# Altium schematic sheet ChronomeV3_2.SchDoc: Chronome Button PCB
size D; DrawnBy: Owen Vallis; Revision: 3.2
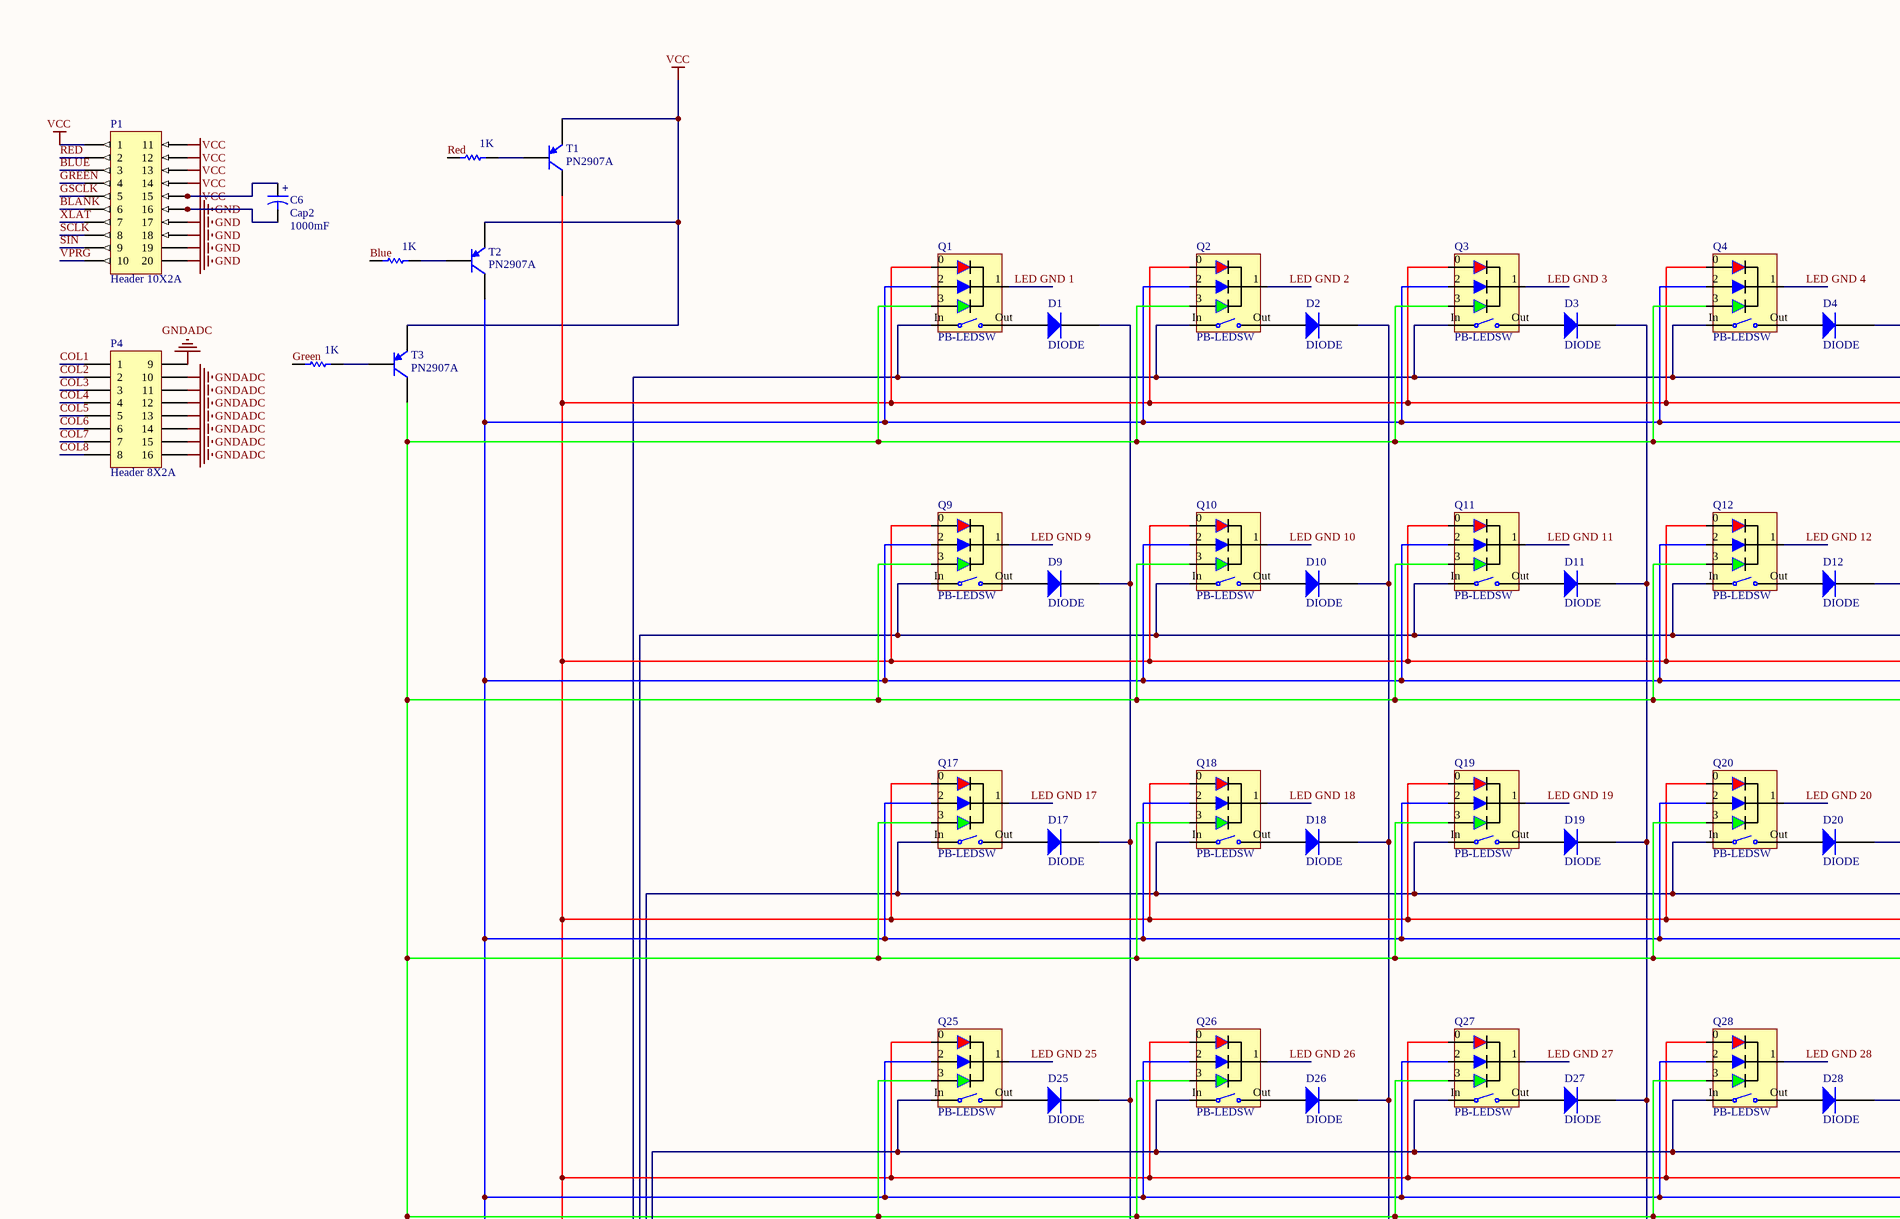
[diagram p0: ChronomeV3_2.SchDoc, top left]
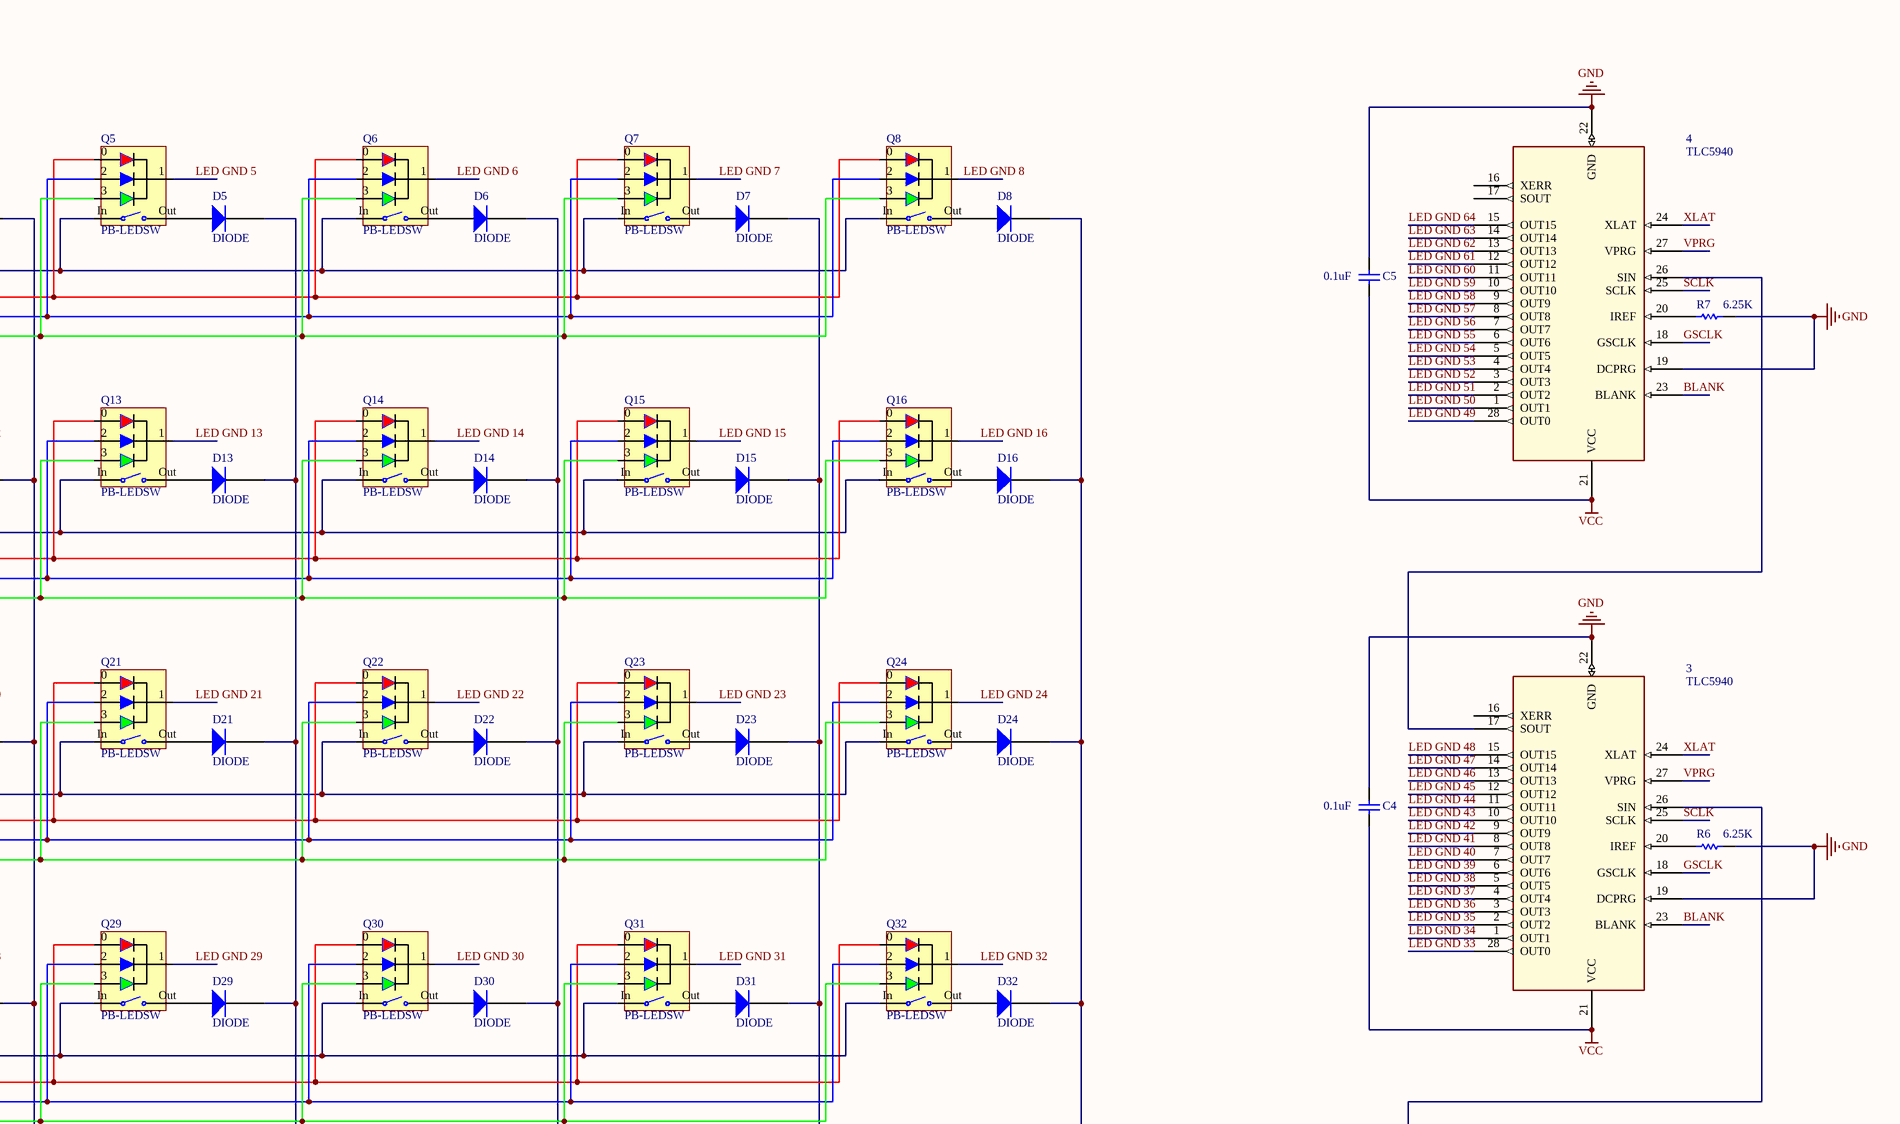
[diagram p1: ChronomeV3_2.SchDoc, top right]
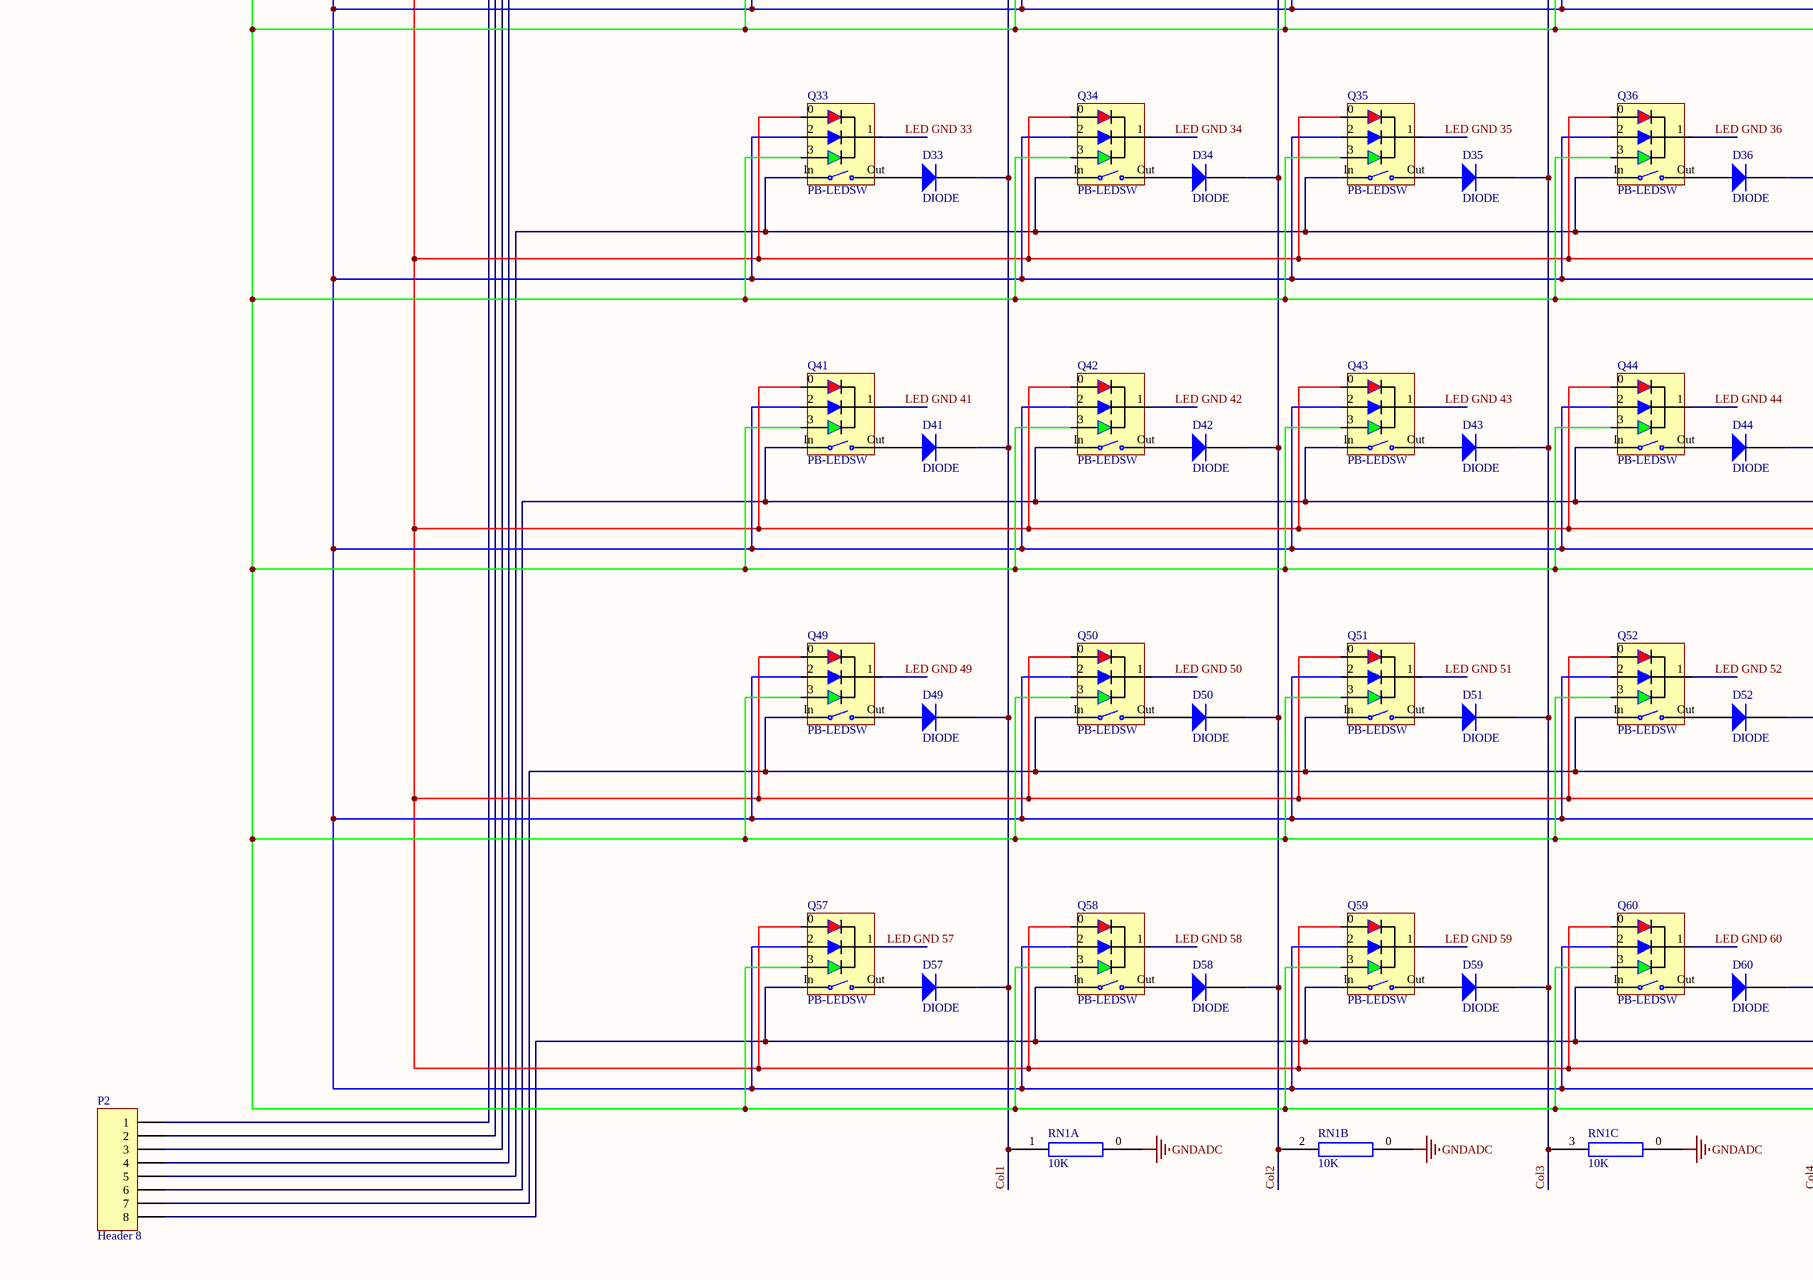
[diagram p2: ChronomeV3_2.SchDoc, bottom left]
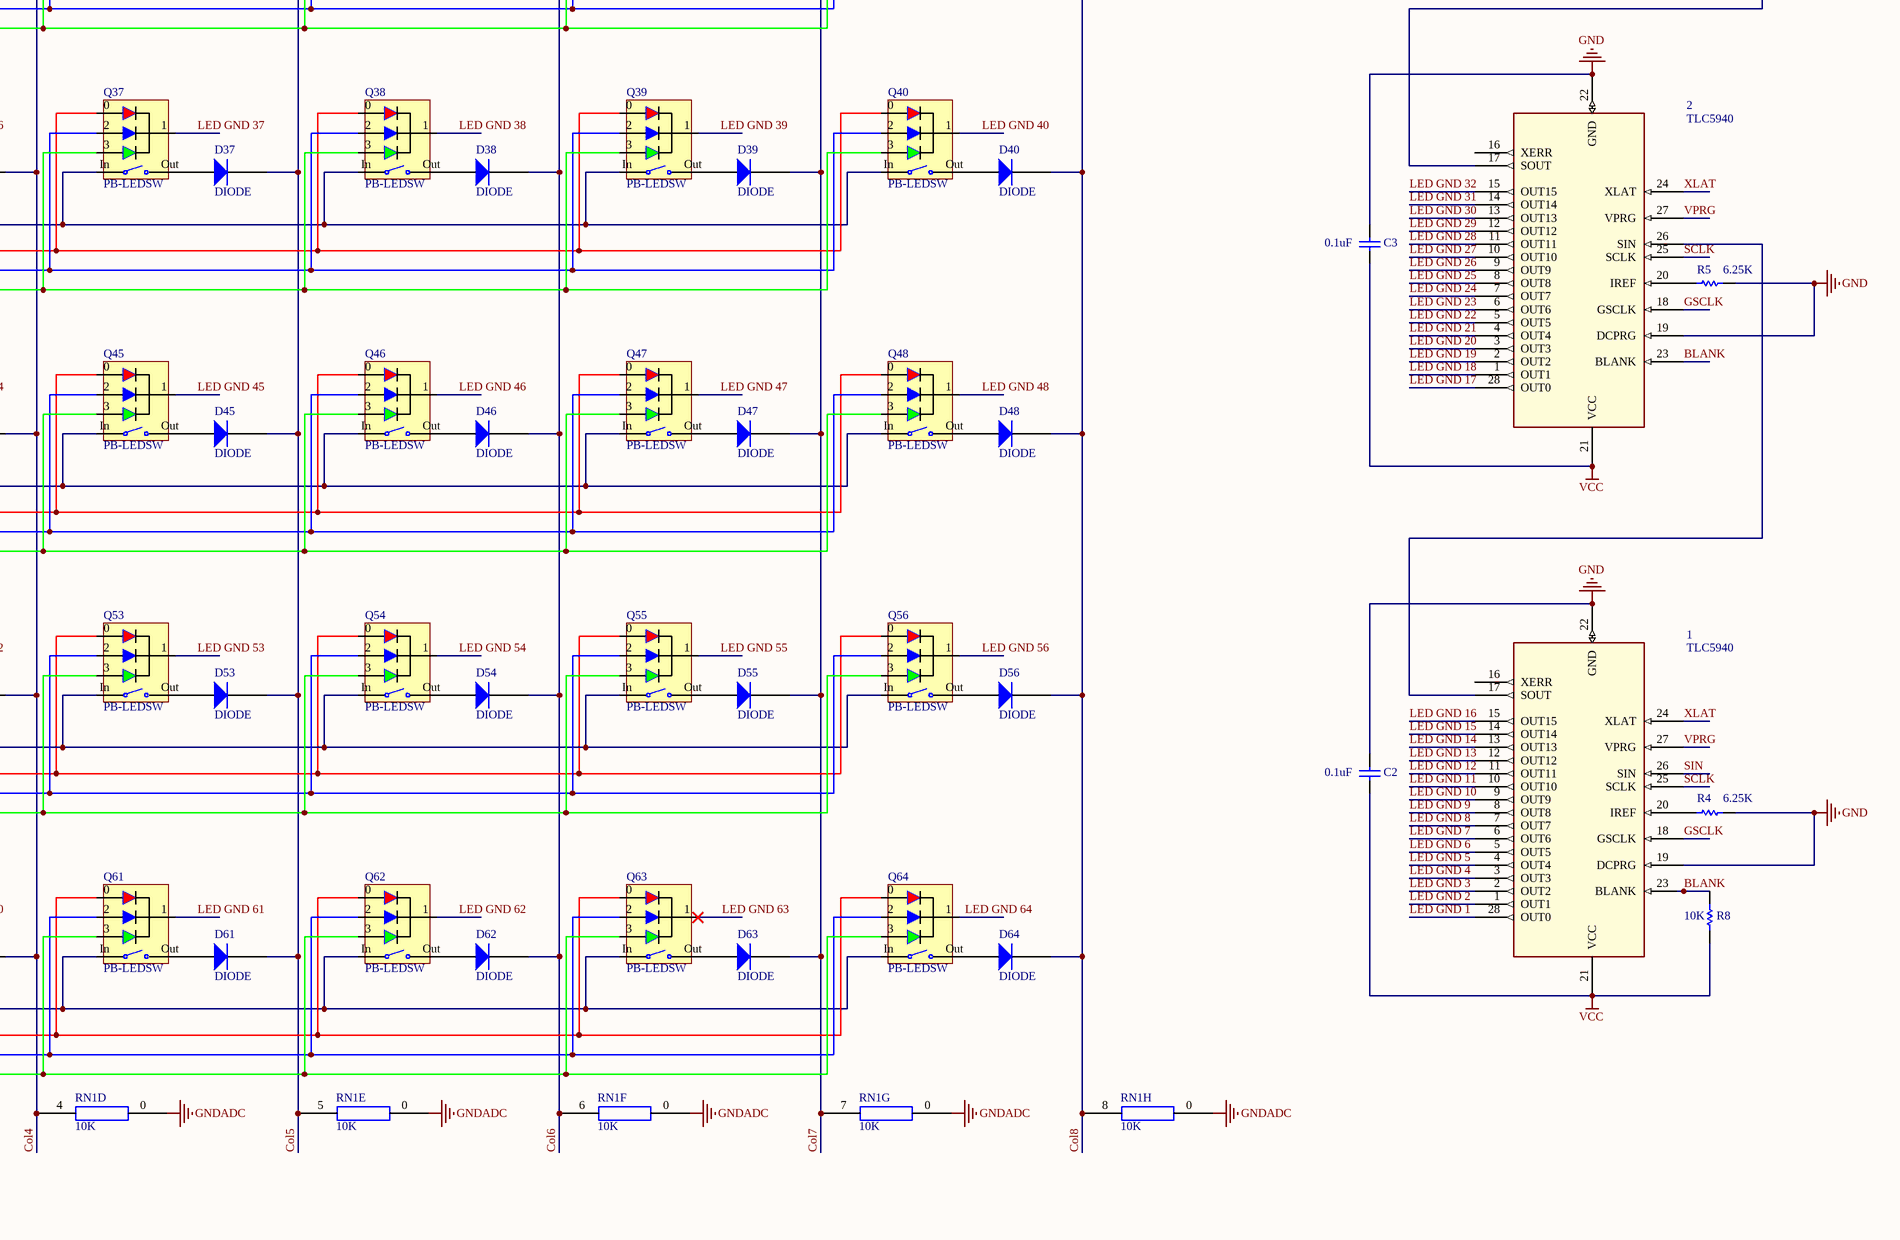
[diagram p3: ChronomeV3_2.SchDoc, bottom right]

## Parts
1  TLC5940  [TLC5940V1]
2  TLC5940  [TLC5940V1]
3  TLC5940  [TLC5940V1]
4  TLC5940  [TLC5940V1]
C2  value 0.1uF  [CAPR2.54-5.1x3.2]  (hidden comment: Cap)
C3  value 0.1uF  [CAPR2.54-5.1x3.2]  (hidden comment: Cap)
C4  value 0.1uF  [CAPR2.54-5.1x3.2]  (hidden comment: Cap)
C5  value 0.1uF  [CAPR2.54-5.1x3.2]  (hidden comment: Cap)
C6  Cap2  value 1000mF  [CAPR5-4X5]
D1  DIODE  [DIODESM]
D2  DIODE  [DIODESM]
D3  DIODE  [DIODESM]
D4  DIODE  [DIODESM]
D5  DIODE  [DIODESM]
D6  DIODE  [DIODESM]
D7  DIODE  [DIODESM]
D8  DIODE  [DIODESM]
D9  DIODE  [DIODESM]
D10  DIODE  [DIODESM]
D11  DIODE  [DIODESM]
D12  DIODE  [DIODESM]
D13  DIODE  [DIODESM]
D14  DIODE  [DIODESM]
D15  DIODE  [DIODESM]
D16  DIODE  [DIODESM]
D17  DIODE  [DIODESM]
D18  DIODE  [DIODESM]
D19  DIODE  [DIODESM]
D20  DIODE  [DIODESM]
D21  DIODE  [DIODESM]
D22  DIODE  [DIODESM]
D23  DIODE  [DIODESM]
D24  DIODE  [DIODESM]
D25  DIODE  [DIODESM]
D26  DIODE  [DIODESM]
D27  DIODE  [DIODESM]
D28  DIODE  [DIODESM]
D29  DIODE  [DIODESM]
D30  DIODE  [DIODESM]
D31  DIODE  [DIODESM]
D32  DIODE  [DIODESM]
D33  DIODE  [DIODESM]
D34  DIODE  [DIODESM]
D35  DIODE  [DIODESM]
D36  DIODE  [DIODESM]
D37  DIODE  [DIODESM]
D38  DIODE  [DIODESM]
D39  DIODE  [DIODESM]
D40  DIODE  [DIODESM]
D41  DIODE  [DIODESM]
D42  DIODE  [DIODESM]
D43  DIODE  [DIODESM]
D44  DIODE  [DIODESM]
D45  DIODE  [DIODESM]
D46  DIODE  [DIODESM]
D47  DIODE  [DIODESM]
D48  DIODE  [DIODESM]
D49  DIODE  [DIODESM]
D50  DIODE  [DIODESM]
D51  DIODE  [DIODESM]
D52  DIODE  [DIODESM]
D53  DIODE  [DIODESM]
D54  DIODE  [DIODESM]
D55  DIODE  [DIODESM]
D56  DIODE  [DIODESM]
D57  DIODE  [DIODESM]
D58  DIODE  [DIODESM]
D59  DIODE  [DIODESM]
D60  DIODE  [DIODESM]
D61  DIODE  [DIODESM]
D62  DIODE  [DIODESM]
D63  DIODE  [DIODESM]
D64  DIODE  [DIODESM]
P1  Header 10X2A  [HDR2X10_CEN]
P2  Header 8  [HDR1X8]
P4  Header 8X2A  [HDR2X8_CEN]
Q1  PB-LEDSW  [RGB_PushButtonV3]
Q2  PB-LEDSW  [RGB_PushButtonV3]
Q3  PB-LEDSW  [RGB_PushButtonV3]
Q4  PB-LEDSW  [RGB_PushButtonV3]
Q5  PB-LEDSW  [RGB_PushButtonV3]
Q6  PB-LEDSW  [RGB_PushButtonV3]
Q7  PB-LEDSW  [RGB_PushButtonV3]
Q8  PB-LEDSW  [RGB_PushButtonV3]
Q9  PB-LEDSW  [RGB_PushButtonV3]
Q10  PB-LEDSW  [RGB_PushButtonV3]
Q11  PB-LEDSW  [RGB_PushButtonV3]
Q12  PB-LEDSW  [RGB_PushButtonV3]
Q13  PB-LEDSW  [RGB_PushButtonV3]
Q14  PB-LEDSW  [RGB_PushButtonV3]
Q15  PB-LEDSW  [RGB_PushButtonV3]
Q16  PB-LEDSW  [RGB_PushButtonV3]
Q17  PB-LEDSW  [RGB_PushButtonV3]
Q18  PB-LEDSW  [RGB_PushButtonV3]
Q19  PB-LEDSW  [RGB_PushButtonV3]
Q20  PB-LEDSW  [RGB_PushButtonV3]
Q21  PB-LEDSW  [RGB_PushButtonV3]
Q22  PB-LEDSW  [RGB_PushButtonV3]
Q23  PB-LEDSW  [RGB_PushButtonV3]
Q24  PB-LEDSW  [RGB_PushButtonV3]
Q25  PB-LEDSW  [RGB_PushButtonV3]
Q26  PB-LEDSW  [RGB_PushButtonV3]
Q27  PB-LEDSW  [RGB_PushButtonV3]
Q28  PB-LEDSW  [RGB_PushButtonV3]
Q29  PB-LEDSW  [RGB_PushButtonV3]
Q30  PB-LEDSW  [RGB_PushButtonV3]
Q31  PB-LEDSW  [RGB_PushButtonV3]
Q32  PB-LEDSW  [RGB_PushButtonV3]
Q33  PB-LEDSW  [RGB_PushButtonV3]
Q34  PB-LEDSW  [RGB_PushButtonV3]
Q35  PB-LEDSW  [RGB_PushButtonV3]
Q36  PB-LEDSW  [RGB_PushButtonV3]
Q37  PB-LEDSW  [RGB_PushButtonV3]
Q38  PB-LEDSW  [RGB_PushButtonV3]
Q39  PB-LEDSW  [RGB_PushButtonV3]
Q40  PB-LEDSW  [RGB_PushButtonV3]
Q41  PB-LEDSW  [RGB_PushButtonV3]
Q42  PB-LEDSW  [RGB_PushButtonV3]
Q43  PB-LEDSW  [RGB_PushButtonV3]
Q44  PB-LEDSW  [RGB_PushButtonV3]
Q45  PB-LEDSW  [RGB_PushButtonV3]
Q46  PB-LEDSW  [RGB_PushButtonV3]
Q47  PB-LEDSW  [RGB_PushButtonV3]
Q48  PB-LEDSW  [RGB_PushButtonV3]
Q49  PB-LEDSW  [RGB_PushButtonV3]
Q50  PB-LEDSW  [RGB_PushButtonV3]
Q51  PB-LEDSW  [RGB_PushButtonV3]
Q52  PB-LEDSW  [RGB_PushButtonV3]
Q53  PB-LEDSW  [RGB_PushButtonV3]
Q54  PB-LEDSW  [RGB_PushButtonV3]
Q55  PB-LEDSW  [RGB_PushButtonV3]
Q56  PB-LEDSW  [RGB_PushButtonV3]
Q57  PB-LEDSW  [RGB_PushButtonV3]
Q58  PB-LEDSW  [RGB_PushButtonV3]
Q59  PB-LEDSW  [RGB_PushButtonV3]
Q60  PB-LEDSW  [RGB_PushButtonV3]
Q61  PB-LEDSW  [RGB_PushButtonV3]
Q62  PB-LEDSW  [RGB_PushButtonV3]
Q63  PB-LEDSW  [RGB_PushButtonV3]
Q64  PB-LEDSW  [RGB_PushButtonV3]
R1  value 1K  [AXIAL-0.3]  (hidden comment: Res1)
R2  value 1K  [AXIAL-0.3]  (hidden comment: Res1)
R3  value 1K  [AXIAL-0.3]  (hidden comment: Res1)
R4  value 6.25K  [AXIAL-0.3]  (hidden comment: Res1)
R5  value 6.25K  [AXIAL-0.3]  (hidden comment: Res1)
R6  value 6.25K  [AXIAL-0.3]  (hidden comment: Res1)
R7  value 6.25K  [AXIAL-0.3]  (hidden comment: Res1)
R8  value 10K  [AXIAL-0.3]  (hidden comment: Res1)
RN1  10K  [9-Pin Resistor Network]  (parts A,B,C,D,E,F,G,H of 8)
T1  PN2907A  [TO-92A]
T2  PN2907A  [TO-92A]
T3  PN2907A  [TO-92A]

## Nets
GND: 1.19(DCPRG) 1.22(GND) 2.19(DCPRG) 2.22(GND) 3.19(DCPRG) 3.22(GND) 4.19(DCPRG) 4.22(GND) C2.2 C3.2 C4.2 C5.2 C6.2 P1.16 P1.17 P1.18 P1.19 P1.20 R4.2 R5.2 R6.2 R7.2
GNDADC: P4.9 P4.10 P4.11 P4.12 P4.13 P4.14 P4.15 P4.16 RN1.0
VCC: 1.21(VCC) 2.21(VCC) 3.21(VCC) 4.21(VCC) C2.1 C3.1 C4.1 C5.1 C6.1 P1.1 P1.11 P1.12 P1.13 P1.14 P1.15 R8.1 T1.1(E) T2.1(E) T3.1(E)
BLANK: 1.23(BLANK) 2.23(BLANK) 3.23(BLANK) 4.23(BLANK) P1.6 R8.2
Blue: P1.3 R2.1
Col1: D1.1 D9.1 D17.1 D25.1 D33.1 D41.1 D49.1 D57.1 P4.1 RN1.1
Col2: D2.1 D10.1 D18.1 D26.1 D34.1 D42.1 D50.1 D58.1 P4.2 RN1.2
Col3: D3.1 D11.1 D19.1 D27.1 D35.1 D43.1 D51.1 D59.1 P4.3 RN1.3
Col4: D4.1 D12.1 D20.1 D28.1 D36.1 D44.1 D52.1 D60.1 P4.4 RN1.4
Col5: D5.1 D13.1 D21.1 D29.1 D37.1 D45.1 D53.1 D61.1 P4.5 RN1.5
Col6: D6.1 D14.1 D22.1 D30.1 D38.1 D46.1 D54.1 D62.1 P4.6 RN1.6
Col7: D7.1 D15.1 D23.1 D31.1 D39.1 D47.1 D55.1 D63.1 P4.7 RN1.7
Col8: D8.1 D16.1 D24.1 D32.1 D40.1 D48.1 D56.1 D64.1 P4.8 RN1.8
Green: P1.4 R3.1
GSCLK: 1.18(GSCLK) 2.18(GSCLK) 3.18(GSCLK) 4.18(GSCLK) P1.5
LED GND 1: 1.28(OUT0) Q1.1(GROUND)
LED GND 2: 1.1(OUT1) Q2.1(GROUND)
LED GND 3: 1.2(OUT2) Q3.1(GROUND)
LED GND 4: 1.3(OUT3) Q4.1(GROUND)
LED GND 5: 1.4(OUT4) Q5.1(GROUND)
LED GND 6: 1.5(OUT5) Q6.1(GROUND)
LED GND 7: 1.6(OUT6) Q7.1(GROUND)
LED GND 8: 1.7(OUT7) Q8.1(GROUND)
LED GND 9: 1.8(OUT8) Q9.1(GROUND)
LED GND 10: 1.9(OUT9) Q10.1(GROUND)
LED GND 11: 1.10(OUT10) Q11.1(GROUND)
LED GND 12: 1.11(OUT11) Q12.1(GROUND)
LED GND 13: 1.12(OUT12) Q13.1(GROUND)
LED GND 14: 1.13(OUT13) Q14.1(GROUND)
LED GND 15: 1.14(OUT14) Q15.1(GROUND)
LED GND 16: 1.15(OUT15) Q16.1(GROUND)
LED GND 17: 2.28(OUT0) Q17.1(GROUND)
LED GND 18: 2.1(OUT1) Q18.1(GROUND)
LED GND 19: 2.2(OUT2) Q19.1(GROUND)
LED GND 20: 2.3(OUT3) Q20.1(GROUND)
LED GND 21: 2.4(OUT4) Q21.1(GROUND)
LED GND 22: 2.5(OUT5) Q22.1(GROUND)
LED GND 23: 2.6(OUT6) Q23.1(GROUND)
LED GND 24: 2.7(OUT7) Q24.1(GROUND)
LED GND 25: 2.8(OUT8) Q25.1(GROUND)
LED GND 26: 2.9(OUT9) Q26.1(GROUND)
LED GND 27: 2.10(OUT10) Q27.1(GROUND)
LED GND 28: 2.11(OUT11) Q28.1(GROUND)
LED GND 29: 2.12(OUT12) Q29.1(GROUND)
LED GND 30: 2.13(OUT13) Q30.1(GROUND)
LED GND 31: 2.14(OUT14) Q31.1(GROUND)
LED GND 32: 2.15(OUT15) Q32.1(GROUND)
LED GND 33: 3.28(OUT0) Q33.1(GROUND)
LED GND 34: 3.1(OUT1) Q34.1(GROUND)
LED GND 35: 3.2(OUT2) Q35.1(GROUND)
LED GND 36: 3.3(OUT3) Q36.1(GROUND)
LED GND 37: 3.4(OUT4) Q37.1(GROUND)
LED GND 38: 3.5(OUT5) Q38.1(GROUND)
LED GND 39: 3.6(OUT6) Q39.1(GROUND)
LED GND 40: 3.7(OUT7) Q40.1(GROUND)
LED GND 41: 3.8(OUT8) Q41.1(GROUND)
LED GND 42: 3.9(OUT9) Q42.1(GROUND)
LED GND 43: 3.10(OUT10) Q43.1(GROUND)
LED GND 44: 3.11(OUT11) Q44.1(GROUND)
LED GND 45: 3.12(OUT12) Q45.1(GROUND)
LED GND 46: 3.13(OUT13) Q46.1(GROUND)
LED GND 47: 3.14(OUT14) Q47.1(GROUND)
LED GND 48: 3.15(OUT15) Q48.1(GROUND)
LED GND 49: 4.28(OUT0) Q49.1(GROUND)
LED GND 50: 4.1(OUT1) Q50.1(GROUND)
LED GND 51: 4.2(OUT2) Q51.1(GROUND)
LED GND 52: 4.3(OUT3) Q52.1(GROUND)
LED GND 53: 4.4(OUT4) Q53.1(GROUND)
LED GND 54: 4.5(OUT5) Q54.1(GROUND)
LED GND 55: 4.6(OUT6) Q55.1(GROUND)
LED GND 56: 4.7(OUT7) Q56.1(GROUND)
LED GND 57: 4.8(OUT8) Q57.1(GROUND)
LED GND 58: 4.9(OUT9) Q58.1(GROUND)
LED GND 59: 4.10(OUT10) Q59.1(GROUND)
LED GND 60: 4.11(OUT11) Q60.1(GROUND)
LED GND 61: 4.12(OUT12) Q61.1(GROUND)
LED GND 62: 4.13(OUT13) Q62.1(GROUND)
LED GND 63: 4.14(OUT14) Q63.1(GROUND)
LED GND 64: 4.15(OUT15) Q64.1(GROUND)
Red: P1.2 R1.1
SCLK: 1.25(SCLK) 2.25(SCLK) 3.25(SCLK) 4.25(SCLK) P1.8
SIN: 1.26(SIN) P1.9
VPRG: 1.27(VPRG) 2.27(VPRG) 3.27(VPRG) 4.27(VPRG) P1.10
XLAT: 1.24(XLAT) 2.24(XLAT) 3.24(XLAT) 4.24(XLAT) P1.7
Net1_17: 1.17(SOUT) 2.26(SIN)
Net1_20: 1.20(IREF) R4.1
Net2_17: 2.17(SOUT) 3.26(SIN)
Net2_20: 2.20(IREF) R5.1
Net3_17: 3.17(SOUT) 4.26(SIN)
Net3_20: 3.20(IREF) R6.1
Net4_20: 4.20(IREF) R7.1
NetD1_0: D1.0 Q1.Out(Switch_Output)
NetD2_0: D2.0 Q2.Out(Switch_Output)
NetD3_0: D3.0 Q3.Out(Switch_Output)
NetD4_0: D4.0 Q4.Out(Switch_Output)
NetD5_0: D5.0 Q5.Out(Switch_Output)
NetD6_0: D6.0 Q6.Out(Switch_Output)
NetD7_0: D7.0 Q7.Out(Switch_Output)
NetD8_0: D8.0 Q8.Out(Switch_Output)
NetD9_0: D9.0 Q9.Out(Switch_Output)
NetD10_0: D10.0 Q10.Out(Switch_Output)
NetD11_0: D11.0 Q11.Out(Switch_Output)
NetD12_0: D12.0 Q12.Out(Switch_Output)
NetD13_0: D13.0 Q13.Out(Switch_Output)
NetD14_0: D14.0 Q14.Out(Switch_Output)
NetD15_0: D15.0 Q15.Out(Switch_Output)
NetD16_0: D16.0 Q16.Out(Switch_Output)
NetD17_0: D17.0 Q17.Out(Switch_Output)
NetD18_0: D18.0 Q18.Out(Switch_Output)
NetD19_0: D19.0 Q19.Out(Switch_Output)
NetD20_0: D20.0 Q20.Out(Switch_Output)
NetD21_0: D21.0 Q21.Out(Switch_Output)
NetD22_0: D22.0 Q22.Out(Switch_Output)
NetD23_0: D23.0 Q23.Out(Switch_Output)
NetD24_0: D24.0 Q24.Out(Switch_Output)
NetD25_0: D25.0 Q25.Out(Switch_Output)
NetD26_0: D26.0 Q26.Out(Switch_Output)
NetD27_0: D27.0 Q27.Out(Switch_Output)
NetD28_0: D28.0 Q28.Out(Switch_Output)
NetD29_0: D29.0 Q29.Out(Switch_Output)
NetD30_0: D30.0 Q30.Out(Switch_Output)
NetD31_0: D31.0 Q31.Out(Switch_Output)
NetD32_0: D32.0 Q32.Out(Switch_Output)
NetD33_0: D33.0 Q33.Out(Switch_Output)
NetD34_0: D34.0 Q34.Out(Switch_Output)
NetD35_0: D35.0 Q35.Out(Switch_Output)
NetD36_0: D36.0 Q36.Out(Switch_Output)
NetD37_0: D37.0 Q37.Out(Switch_Output)
NetD38_0: D38.0 Q38.Out(Switch_Output)
NetD39_0: D39.0 Q39.Out(Switch_Output)
NetD40_0: D40.0 Q40.Out(Switch_Output)
NetD41_0: D41.0 Q41.Out(Switch_Output)
NetD42_0: D42.0 Q42.Out(Switch_Output)
NetD43_0: D43.0 Q43.Out(Switch_Output)
NetD44_0: D44.0 Q44.Out(Switch_Output)
NetD45_0: D45.0 Q45.Out(Switch_Output)
NetD46_0: D46.0 Q46.Out(Switch_Output)
NetD47_0: D47.0 Q47.Out(Switch_Output)
NetD48_0: D48.0 Q48.Out(Switch_Output)
NetD49_0: D49.0 Q49.Out(Switch_Output)
NetD50_0: D50.0 Q50.Out(Switch_Output)
NetD51_0: D51.0 Q51.Out(Switch_Output)
NetD52_0: D52.0 Q52.Out(Switch_Output)
NetD53_0: D53.0 Q53.Out(Switch_Output)
NetD54_0: D54.0 Q54.Out(Switch_Output)
NetD55_0: D55.0 Q55.Out(Switch_Output)
NetD56_0: D56.0 Q56.Out(Switch_Output)
NetD57_0: D57.0 Q57.Out(Switch_Output)
NetD58_0: D58.0 Q58.Out(Switch_Output)
NetD59_0: D59.0 Q59.Out(Switch_Output)
NetD60_0: D60.0 Q60.Out(Switch_Output)
NetD61_0: D61.0 Q61.Out(Switch_Output)
NetD62_0: D62.0 Q62.Out(Switch_Output)
NetD63_0: D63.0 Q63.Out(Switch_Output)
NetD64_0: D64.0 Q64.Out(Switch_Output)
NetP2_1: P2.1 Q1.In(Switch_Input) Q2.In(Switch_Input) Q3.In(Switch_Input) Q4.In(Switch_Input) Q5.In(Switch_Input) Q6.In(Switch_Input) Q7.In(Switch_Input) Q8.In(Switch_Input)
NetP2_2: P2.2 Q9.In(Switch_Input) Q10.In(Switch_Input) Q11.In(Switch_Input) Q12.In(Switch_Input) Q13.In(Switch_Input) Q14.In(Switch_Input) Q15.In(Switch_Input) Q16.In(Switch_Input)
NetP2_3: P2.3 Q17.In(Switch_Input) Q18.In(Switch_Input) Q19.In(Switch_Input) Q20.In(Switch_Input) Q21.In(Switch_Input) Q22.In(Switch_Input) Q23.In(Switch_Input) Q24.In(Switch_Input)
NetP2_4: P2.4 Q25.In(Switch_Input) Q26.In(Switch_Input) Q27.In(Switch_Input) Q28.In(Switch_Input) Q29.In(Switch_Input) Q30.In(Switch_Input) Q31.In(Switch_Input) Q32.In(Switch_Input)
NetP2_5: P2.5 Q33.In(Switch_Input) Q34.In(Switch_Input) Q35.In(Switch_Input) Q36.In(Switch_Input) Q37.In(Switch_Input) Q38.In(Switch_Input) Q39.In(Switch_Input) Q40.In(Switch_Input)
NetP2_6: P2.6 Q41.In(Switch_Input) Q42.In(Switch_Input) Q43.In(Switch_Input) Q44.In(Switch_Input) Q45.In(Switch_Input) Q46.In(Switch_Input) Q47.In(Switch_Input) Q48.In(Switch_Input)
NetP2_7: P2.7 Q49.In(Switch_Input) Q50.In(Switch_Input) Q51.In(Switch_Input) Q52.In(Switch_Input) Q53.In(Switch_Input) Q54.In(Switch_Input) Q55.In(Switch_Input) Q56.In(Switch_Input)
NetP2_8: P2.8 Q57.In(Switch_Input) Q58.In(Switch_Input) Q59.In(Switch_Input) Q60.In(Switch_Input) Q61.In(Switch_Input) Q62.In(Switch_Input) Q63.In(Switch_Input) Q64.In(Switch_Input)
NetQ1_0: Q1.0(RED) Q2.0(RED) Q3.0(RED) Q4.0(RED) Q5.0(RED) Q6.0(RED) Q7.0(RED) Q8.0(RED) Q9.0(RED) Q10.0(RED) Q11.0(RED) Q12.0(RED) Q13.0(RED) Q14.0(RED) Q15.0(RED) Q16.0(RED) Q17.0(RED) Q18.0(RED) Q19.0(RED) Q20.0(RED) Q21.0(RED) Q22.0(RED) Q23.0(RED) Q24.0(RED) Q25.0(RED) Q26.0(RED) Q27.0(RED) Q28.0(RED) Q29.0(RED) Q30.0(RED) Q31.0(RED) Q32.0(RED) Q33.0(RED) Q34.0(RED) Q35.0(RED) Q36.0(RED) Q37.0(RED) Q38.0(RED) Q39.0(RED) Q40.0(RED) Q41.0(RED) Q42.0(RED) Q43.0(RED) Q44.0(RED) Q45.0(RED) Q46.0(RED) Q47.0(RED) Q48.0(RED) Q49.0(RED) Q50.0(RED) Q51.0(RED) Q52.0(RED) Q53.0(RED) Q54.0(RED) Q55.0(RED) Q56.0(RED) Q57.0(RED) Q58.0(RED) Q59.0(RED) Q60.0(RED) Q61.0(RED) Q62.0(RED) Q63.0(RED) Q64.0(RED) T1.3(C)
NetQ1_2: Q1.2(GREEN) Q2.2(GREEN) Q3.2(GREEN) Q4.2(GREEN) Q5.2(GREEN) Q6.2(GREEN) Q7.2(GREEN) Q8.2(GREEN) Q9.2(GREEN) Q10.2(GREEN) Q11.2(GREEN) Q12.2(GREEN) Q13.2(GREEN) Q14.2(GREEN) Q15.2(GREEN) Q16.2(GREEN) Q17.2(GREEN) Q18.2(GREEN) Q19.2(GREEN) Q20.2(GREEN) Q21.2(GREEN) Q22.2(GREEN) Q23.2(GREEN) Q24.2(GREEN) Q25.2(GREEN) Q26.2(GREEN) Q27.2(GREEN) Q28.2(GREEN) Q29.2(GREEN) Q30.2(GREEN) Q31.2(GREEN) Q32.2(GREEN) Q33.2(GREEN) Q34.2(GREEN) Q35.2(GREEN) Q36.2(GREEN) Q37.2(GREEN) Q38.2(GREEN) Q39.2(GREEN) Q40.2(GREEN) Q41.2(GREEN) Q42.2(GREEN) Q43.2(GREEN) Q44.2(GREEN) Q45.2(GREEN) Q46.2(GREEN) Q47.2(GREEN) Q48.2(GREEN) Q49.2(GREEN) Q50.2(GREEN) Q51.2(GREEN) Q52.2(GREEN) Q53.2(GREEN) Q54.2(GREEN) Q55.2(GREEN) Q56.2(GREEN) Q57.2(GREEN) Q58.2(GREEN) Q59.2(GREEN) Q60.2(GREEN) Q61.2(GREEN) Q62.2(GREEN) Q63.2(GREEN) Q64.2(GREEN) T2.3(C)
NetQ1_3: Q1.3(Blue) Q2.3(Blue) Q3.3(Blue) Q4.3(Blue) Q5.3(Blue) Q6.3(Blue) Q7.3(Blue) Q8.3(Blue) Q9.3(Blue) Q10.3(Blue) Q11.3(Blue) Q12.3(Blue) Q13.3(Blue) Q14.3(Blue) Q15.3(Blue) Q16.3(Blue) Q17.3(Blue) Q18.3(Blue) Q19.3(Blue) Q20.3(Blue) Q21.3(Blue) Q22.3(Blue) Q23.3(Blue) Q24.3(Blue) Q25.3(Blue) Q26.3(Blue) Q27.3(Blue) Q28.3(Blue) Q29.3(Blue) Q30.3(Blue) Q31.3(Blue) Q32.3(Blue) Q33.3(Blue) Q34.3(Blue) Q35.3(Blue) Q36.3(Blue) Q37.3(Blue) Q38.3(Blue) Q39.3(Blue) Q40.3(Blue) Q41.3(Blue) Q42.3(Blue) Q43.3(Blue) Q44.3(Blue) Q45.3(Blue) Q46.3(Blue) Q47.3(Blue) Q48.3(Blue) Q49.3(Blue) Q50.3(Blue) Q51.3(Blue) Q52.3(Blue) Q53.3(Blue) Q54.3(Blue) Q55.3(Blue) Q56.3(Blue) Q57.3(Blue) Q58.3(Blue) Q59.3(Blue) Q60.3(Blue) Q61.3(Blue) Q62.3(Blue) Q63.3(Blue) Q64.3(Blue) T3.3(C)
NetR1_2: R1.2 T1.2(B)
NetR2_2: R2.2 T2.2(B)
NetR3_2: R3.2 T3.2(B)

Not connected (* = marked no-connect by the designer): 1 16(XERR); 2 16(XERR); 3 16(XERR); 4 16(XERR) 17(SOUT)

## Notes on the sheet
- (near C6) +

## Library data of the parts
C2-C5 = Cap: Capacitor; Published: 8-Jun-2000; LatestRevisionDate: 17-Jul-2002; LatestRevisionNote: Re-released for DXP Platform.; PackageReference: RAD-0.3; Publisher: Altium Limited
C6 = Cap2: Capacitor; Published: 23-Sep-2002; PackageReference: CAPR5-4X5; Publisher: Altium Limited
P1 = Header 10X2A: Header, 10-Pin, Dual row; LatestRevisionDate: 17-Jul-2002; LatestRevisionNote: Re-released for DXP Platform.; Publisher: Altium Limited
P2 = Header 8: Header, 8-Pin; LatestRevisionDate: 17-Jul-2002; LatestRevisionNote: Re-released for DXP Platform.; Publisher: Altium Limited
P4 = Header 8X2A: Header, 8-Pin, Dual row; LatestRevisionDate: 17-Jul-2002; LatestRevisionNote: Re-released for DXP Platform.; Publisher: Altium Limited
Q1-Q64 = Push Button: Push Button RGB LED
R1-R8 = Res1: Resistor; Published: 8-Jun-2000; LatestRevisionDate: 17-Jul-2002; LatestRevisionNote: Re-released for DXP Platform.; PackageReference: AXIAL-0.3; Publisher: Altium Limited
RN1 = Res1
T1-T3 = PN2907A: PNP General Purpose Amplifier; Published: 8-Jun-2000; LatestRevisionDate: 17-Jan-2003; LatestRevisionNote: PCB Footprint 'BCY-W3/D4.7' replaced; DatasheetDocument: 1997; PackageDocument: Sep-1998; PackageReference: TO-92A; Publisher: Altium Limited; ComponentLink1Description: Manufacturer Link; ComponentLink1URL: http://www.fairchildsemi.com/; ComponentLink2Description: Discontinuation Notice; ComponentLink2URL: http://www.fairchildsemi.com/obsolete/obs.jsp